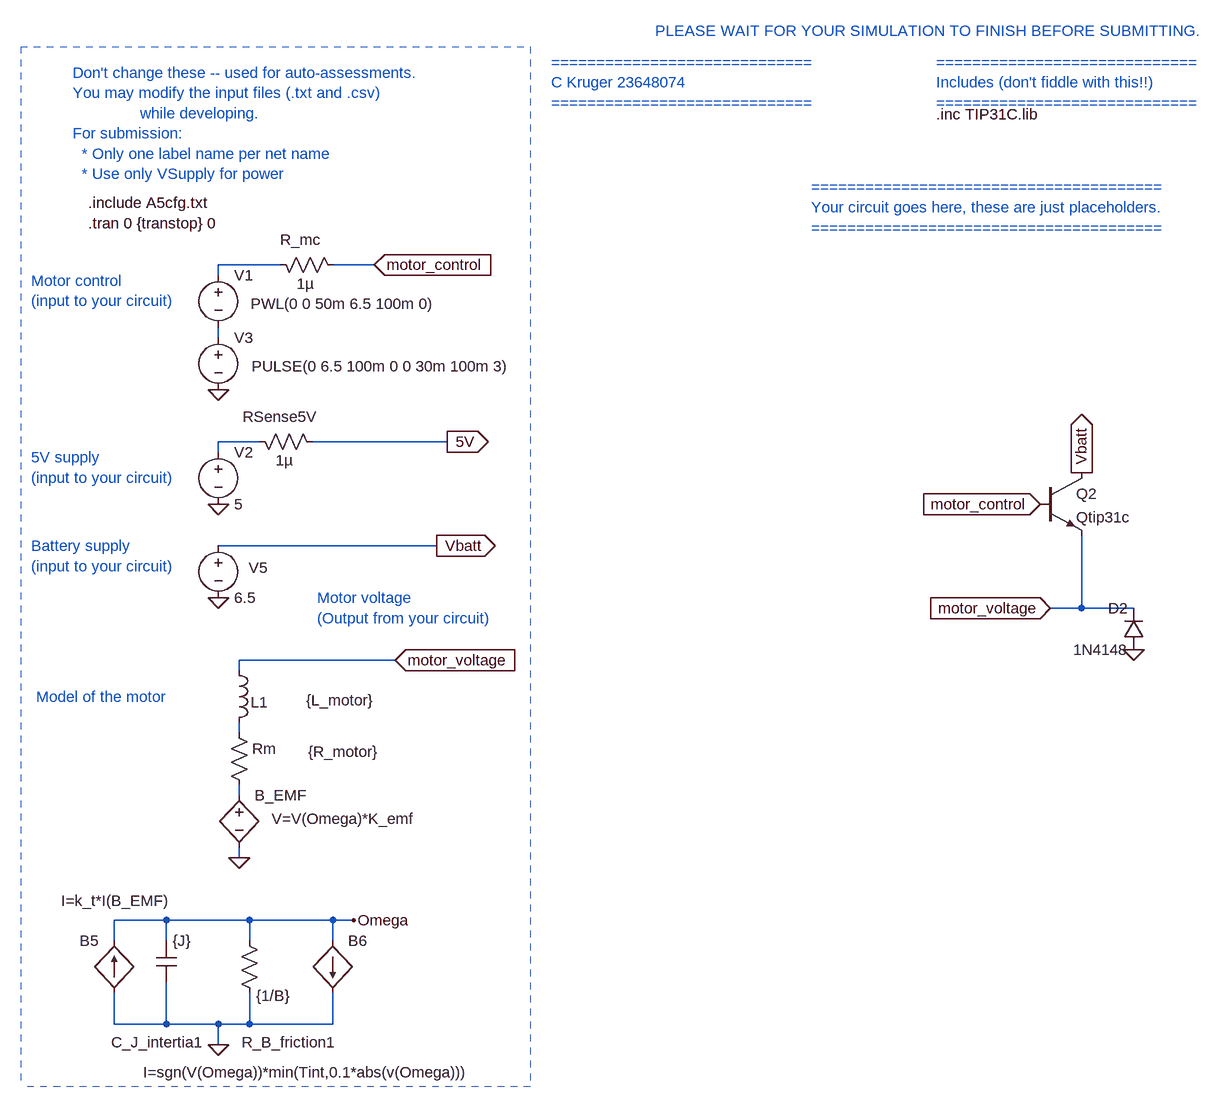
[diagram p0: schematic E344_23648074_A4b.asc]
E344_23648074_A4b.asc, the LTspice schematic file:
Version 4
SHEET 1 1824 2192
WIRE -1968 -1088 -2064 -1088
WIRE -1824 -1088 -1888 -1088
WIRE -2064 -1072 -2064 -1088
WIRE -2064 -976 -2064 -992
WIRE -2000 -816 -2064 -816
WIRE -1712 -816 -1920 -816
WIRE -2064 -800 -2064 -816
WIRE -1728 -656 -2064 -656
WIRE -736 -560 -736 -672
WIRE -736 -560 -784 -560
WIRE -656 -560 -736 -560
WIRE -1792 -480 -2032 -480
WIRE -2032 -464 -2032 -480
WIRE -2032 -368 -2032 -384
WIRE -2032 -272 -2032 -288
WIRE -2032 -176 -2032 -192
WIRE -2144 -80 -2224 -80
WIRE -2016 -80 -2144 -80
WIRE -1888 -80 -2016 -80
WIRE -1856 -80 -1888 -80
WIRE -2224 -48 -2224 -80
WIRE -2144 -48 -2144 -80
WIRE -2016 -48 -2016 -80
WIRE -1888 -48 -1888 -80
WIRE -2224 80 -2224 32
WIRE -2144 80 -2144 16
WIRE -2144 80 -2224 80
WIRE -2064 80 -2144 80
WIRE -2016 80 -2016 32
WIRE -2016 80 -2064 80
WIRE -1888 80 -1888 32
WIRE -1888 80 -2016 80
WIRE -2064 112 -2064 80
FLAG -1712 -816 5V
IOPIN -1712 -816 Out
FLAG -2064 -720 0
FLAG -2064 -896 0
FLAG -1824 -1088 motor_control
IOPIN -1824 -1088 In
FLAG -800 -720 motor_control
IOPIN -800 -720 In
FLAG -736 -768 Vbatt
IOPIN -736 -768 Out
FLAG -2064 -576 0
FLAG -1728 -656 Vbatt
IOPIN -1728 -656 Out
FLAG -1792 -480 motor_voltage
IOPIN -1792 -480 In
FLAG -1856 -80 Omega
FLAG -2064 112 0
FLAG -2032 -176 0
FLAG -784 -560 motor_voltage
IOPIN -784 -560 In
FLAG -656 -496 0
SYMBOL voltage -2064 -816 R0
WINDOW 123 0 0 Left 0
WINDOW 39 0 0 Left 0
SYMATTR InstName V2
SYMATTR Value 5
SYMBOL res -2016 -832 M90
WINDOW 0 -7 47 VBottom 2
WINDOW 3 29 54 VTop 2
SYMATTR InstName RSense5V
SYMATTR Value 1µ
SYMBOL diode -640 -496 R180
WINDOW 0 24 64 Left 2
WINDOW 3 24 0 Left 2
SYMATTR InstName D2
SYMATTR Value 1N4148
SYMBOL voltage -2064 -1088 R0
WINDOW 123 0 0 Left 0
WINDOW 39 0 0 Left 0
WINDOW 3 50 60 Left 2
SYMATTR Value PWL(0 0 50m 6.5 100m 0)
SYMATTR InstName V1
SYMBOL voltage -2064 -992 R0
WINDOW 123 0 0 Left 0
WINDOW 39 0 0 Left 0
WINDOW 3 51 60 Left 2
SYMATTR Value PULSE(0 6.5 100m 0 0 30m 100m 3)
SYMATTR InstName V3
SYMBOL npn2 -800 -768 R0
SYMATTR InstName Q2
SYMATTR Value Qtip31c
SYMBOL voltage -2064 -672 R0
WINDOW 123 0 0 Left 0
WINDOW 39 0 0 Left 0
WINDOW 0 47 50 Left 2
SYMATTR InstName V5
SYMATTR Value 6.5
SYMBOL res -2048 -384 R0
WINDOW 3 122 45 Left 2
SYMATTR Value {R_motor}
SYMATTR InstName Rm
SYMBOL ind -2048 -480 R0
WINDOW 0 34 65 Left 2
WINDOW 3 119 62 Left 2
SYMATTR InstName L1
SYMATTR Value {L_motor}
SYMBOL bv -2032 -288 R0
WINDOW 3 50 52 Left 2
SYMATTR Value V=V(Omega)*K_emf
SYMATTR InstName B_EMF
SYMBOL bi -2224 32 R180
WINDOW 0 24 80 Left 2
WINDOW 3 -84 142 Left 2
SYMATTR InstName B5
SYMATTR Value I=k_t*I(B_EMF)
SYMBOL bi -1888 -48 R0
WINDOW 3 -292 202 Left 2
SYMATTR Value I=sgn(V(Omega))*min(Tint,0.1*abs(v(Omega)))
SYMATTR InstName B6
SYMBOL cap -2160 -48 R0
WINDOW 0 -69 156 Left 2
WINDOW 3 26 0 Left 2
SYMATTR InstName C_J_intertia1
SYMATTR Value {J}
SYMBOL res -2032 -64 R0
WINDOW 0 4 172 Left 2
WINDOW 3 26 100 Left 2
SYMATTR InstName R_B_friction1
SYMATTR Value {1/B}
SYMBOL res -1984 -1104 M90
WINDOW 0 -7 47 VBottom 2
WINDOW 3 29 54 VTop 2
SYMATTR InstName R_mc
SYMATTR Value 1µ
TEXT -2288 -1384 Left 2 ;Don't change these -- used for auto-assessments.\nYou may modify the input files (.txt and .csv) \n               while developing.\nFor submission: \n  * Only one label name per net name\n  * Use only VSupply for power
TEXT -1552 -1400 Left 2 ;=============================\nC Kruger 23648074\n=============================
TEXT -960 -1320 Left 2 !.inc TIP31C.lib
TEXT -960 -1400 Left 2 ;=============================\nIncludes (don't fiddle with this!!)\n=============================
TEXT -1152 -1208 Left 2 ;=======================================\nYour circuit goes here, these are just placeholders.\n=======================================
TEXT -1392 -1448 Left 2 ;PLEASE WAIT FOR YOUR SIMULATION TO FINISH BEFORE SUBMITTING.
TEXT -2264 -1152 Left 2 !.tran 0 {transtop} 0
TEXT -2264 -1184 Left 2 !.include A5cfg.txt
TEXT -2352 -1064 Left 2 ;Motor control\n(input to your circuit)
TEXT -2352 -792 Left 2 ;5V supply \n(input to your circuit)
TEXT -2352 -656 Left 2 ;Battery supply \n(input to your circuit)
TEXT -1912 -576 Left 2 ;Motor voltage\n(Output from your circuit)
TEXT -2344 -424 Left 2 ;Model of the motor
LINE Normal -1584 -1424 -1584 176 2
LINE Normal -2368 -1424 -1584 -1424 2
LINE Normal -1584 176 -2368 176 2
LINE Normal -2368 -1424 -2368 176 2

The netlist it stands for:
* E344_23648074_A4b.asc
V2 N003 0 5
RSense5V N003 5V 1µ
D2 0 motor_voltage 1N4148
V1 N001 N002 PWL(0 0 50m 6.5 100m 0)
V3 N002 0 PULSE(0 6.5 100m 0 0 30m 100m 3)
Q2 Vbatt motor_control motor_voltage 0 Qtip31c
V5 Vbatt 0 6.5
Rm N004 N005 {R_motor}
L1 motor_voltage N004 {L_motor}
B_EMF N005 0 V=V(Omega)*K_emf
B5 0 Omega I=k_t*I(B_EMF)
B6 Omega 0 I=sgn(V(Omega))*min(Tint,0.1*abs(v(Omega)))
C_J_intertia1 Omega 0 {J}
R_B_friction1 Omega 0 {1/B}
R_mc N001 motor_control 1µ
.model D D
.lib standard.dio
.model NPN NPN
.model PNP PNP
.lib standard.bjt
* Don't change these -- used for auto-assessments.
* You may modify the input files (.txt and .csv)
*                while developing.
* For submission:
*   * Only one label name per net name
*   * Use only VSupply for power
* =============================
* C Kruger 23648074
* =============================
.inc TIP31C.lib
* =============================
* Includes (don't fiddle with this!!)
* =============================
* =======================================
* Your circuit goes here, these are just placeholders.
* =======================================
* PLEASE WAIT FOR YOUR SIMULATION TO FINISH BEFORE SUBMITTING.
.tran 0 {transtop} 0
.include A5cfg.txt
* Motor control
* (input to your circuit)
* 5V supply
* (input to your circuit)
* Battery supply
* (input to your circuit)
* Motor voltage
* (Output from your circuit)
* Model of the motor
.backanno
.end